# Altium schematic sheet QPA9120.SchDoc
size A4; SheetNumber: 2; SheetTotal: 4
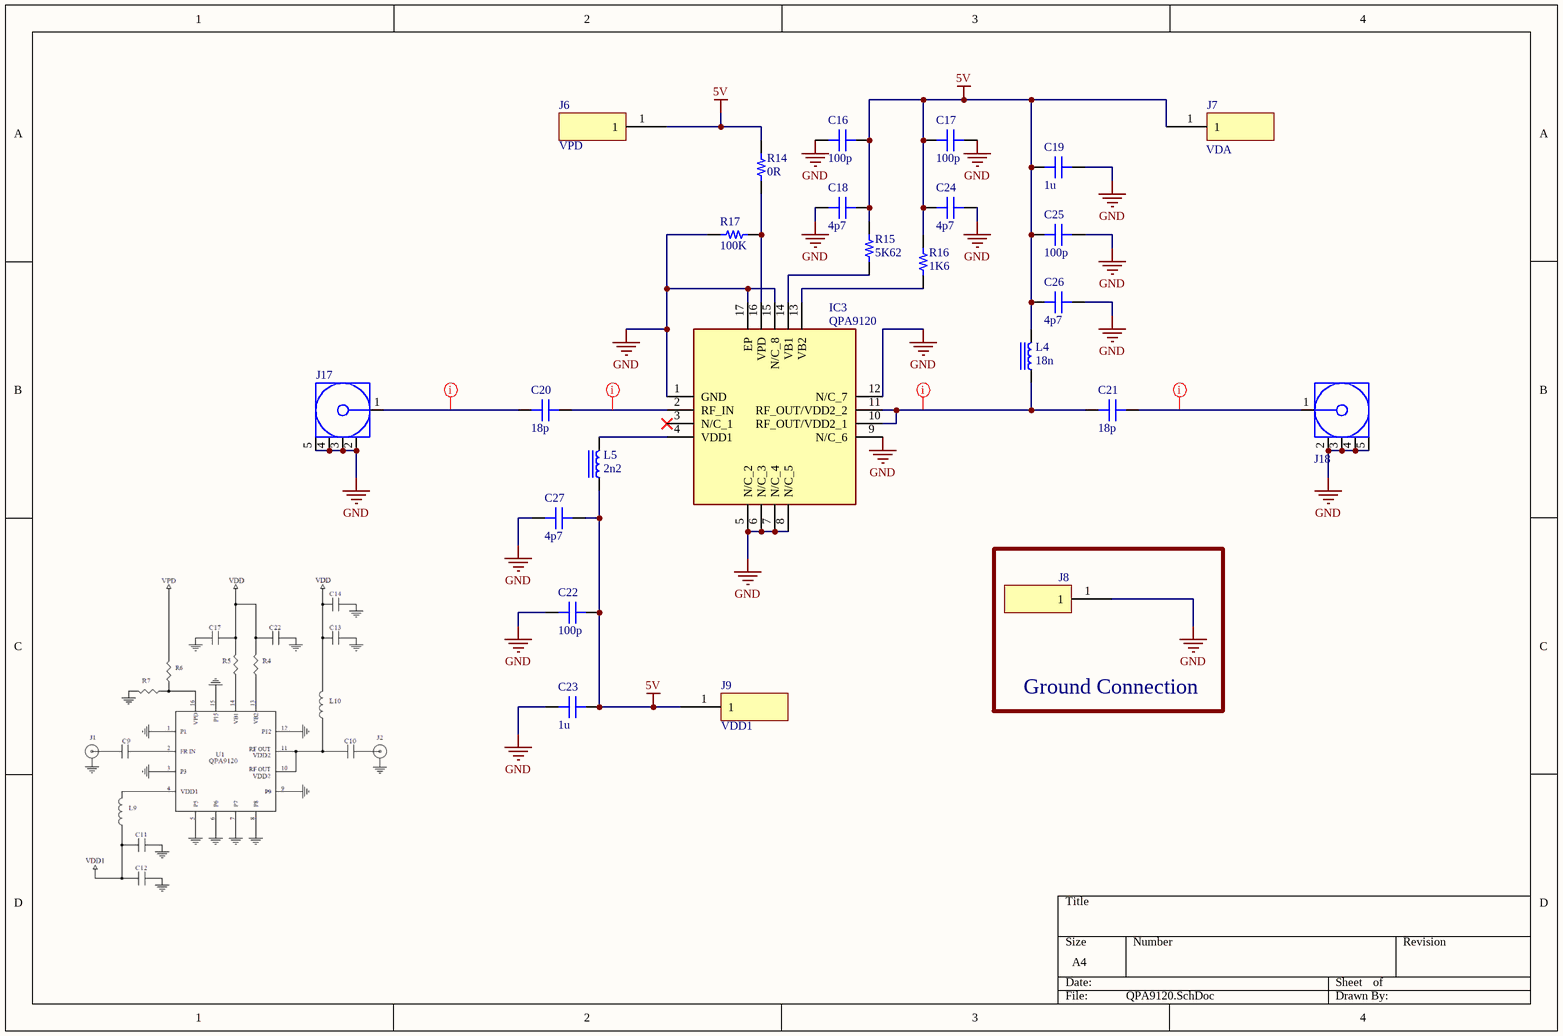
[diagram p0: QPA9120.SchDoc]

## Parts
C16  100p  [CAP 0603_1608 RF]
C17  100p  [CAP 0603_1608 RF]
C18  4p7  [CAP 0402_1005 RF]
C19  1u  [CAP 0603_1608]
C20  18p  [CAP 0402_1005 RF]
C21  18p  [CAP 0402_1005 RF]
C22  100p  [CAP 0603_1608 RF]
C23  1u  [CAP 0603_1608]
C24  4p7  [CAP 0402_1005 RF]
C25  100p  [CAP 0603_1608 RF]
C26  4p7  [CAP 0402_1005 RF]
C27  4p7  [CAP 0402_1005 RF]
IC3  QPA9120  [QFN50P300X300X86-17N-D]
J6  Nail_Head  [Nail_Head]  (value not drawn)
J7  Nail_Head  [Nail_Head]  (value not drawn)
J8  Nail_Head  [Nail_Head]  (value not drawn)
J9  Nail_Head  [Nail_Head]  (value not drawn)
J17  60312202114513  [60312202114513]  (value not drawn)
J18  60312202114513  [60312202114513]  (value not drawn)
L4  18n  [IND 0402_1005 RF WW]
L5  2n2  [IND 0402_1005 RF WW]
R14  0R  [RES 0603_1608]
R15  5K62  [RES 0402_1005]
R16  1K6  [RES 0402_1005]
R17  100K  [RES 0402_1005]

## Blocks framed on the sheet
Ground Connection: J8

## Nets
5V: C16.2 C17.1 C18.2 C19.1 C22.2 C23.2 C24.1 C25.1 C26.1 C27.2 J6.1 J7.1 J9.1 L4.2 L5.1 R14.2 R15.2 R16.2
GND: C16.1 C17.2 C18.1 C19.2 C22.1 C23.1 C24.2 C25.2 C26.2 C27.1 IC3.1(GND) IC3.5(N/C_2) IC3.6(N/C_3) IC3.7(N/C_4) IC3.8(N/C_5) IC3.9(N/C_6) IC3.12(N/C_7) IC3.15(N/C_8) IC3.17(EP) J8.1 J17.2(GND) J17.3(GND) J17.4(GND) J17.5(GND) J18.2(GND) J18.3(GND) J18.4(GND) J18.5(GND) R17.1
NetC20_1: C20.1 J17.1(Signal)
NetC20_2: C20.2 IC3.2(RF_IN)
NetC21_1: C21.1 IC3.10(RF_OUT/VDD2_1) IC3.11(RF_OUT/VDD2_2) L4.1
NetC21_2: C21.2 J18.1(Signal)
NetIC3_4: IC3.4(VDD1) L5.2
NetIC3_13: IC3.13(VB2) R16.1
NetIC3_14: IC3.14(VB1) R15.1
NetIC3_16: IC3.16(VPD) R14.1 R17.2

Not connected (* = marked no-connect by the designer): IC3 3(N/C_1)*

## Layout directives
net class CPWG: NetC20_1, NetC20_2, NetC21_1, NetC21_2

## Notes on the sheet
- (near J6) VPD
- (near J7) VDA
- (near J9) VDD1

## Library data of the parts
C16 C17 C22 C25 = 600S101GW250XT: CAP CER 100PF 250V NP0 0603; manufacturer: American Technical Ceramics; Temperature Coefficient: C0G, NP0; Tolerance: ±2%; Part Number: 600S101GW250XT; Applications: RF, Microwave, High Frequency, Bypass, Decoupling; Capacitance: 100 pF; componentlink1description: Datasheet; componentlink1url: http://www.atceramics.com/UserFiles/600s.pdf; componentlink2description: DigiKey Link; componentlink2url: https://www.digikey.com/en/products/detail/american-technical-ceramics/600S101GW250XT/3908987; Device Package: 0603 (1608 Metric); Features: High Q, Low Loss, Ultra Low ESR; lastupdated: 08/02/2024 21:16:59; Lifecycle Status: Active; Minimum Order: 1; Mounting Type: Surface Mount, MLCC; Operating Temperature: -55°C ~ 125°C; Package / Case: 0603 (1608 Metric); packaging: TapeAndReel; partid: 2165; Part Status: Active; price: 0.66; series: ATC 600S; Size / Dimension: 0.063" L x 0.032" W (1.60mm x 0.81mm); Supplier 1: DigiKey; Supplier Part Number 1: 1284-1931-1-ND; Thickness (Max): 0.035" (0.89mm); value: 100 pF; Voltage - Rated: 250V
C18 C24 C26 C27 = 600L4R7BT200T: CAP CER 4.7PF 200V C0G/NP0 0402; manufacturer: American Technical Ceramics; Temperature Coefficient: C0G, NP0; Tolerance: ±0.1pF; Part Number: 600L4R7BT200T; Applications: RF, Microwave, High Frequency, Bypass, Decoupling; Capacitance: 4.7 pF; componentlink1description: Datasheet; componentlink1url: http://www.atceramics.com/UserFiles/600l.pdf; componentlink2description: DigiKey Link; componentlink2url: https://www.digikey.com/en/products/detail/american-technical-ceramics/600L4R7BT200T/3905170; Device Package: 0402 (1005 Metric); Features: High Q, Low Loss, Ultra Low ESR; lastupdated: 08/02/2024 21:11:52; Lifecycle Status: Active; Minimum Order: 1; Mounting Type: Surface Mount, MLCC; Operating Temperature: -55°C ~ 125°C; Package / Case: 0402 (1005 Metric); packaging: TapeAndReel; partid: 546; Part Status: Active; price: 0.28; series: ATC 600L; Size / Dimension: 0.040" L x 0.020" W (1.02mm x 0.51mm); Supplier 1: DigiKey; Supplier Part Number 1: 1284-1129-1-ND; Thickness (Max): 0.024" (0.60mm); value: 4.7 pF; Voltage - Rated: 200V
C19 C23 = GCM188R71E105KA64J: CAP CER 1UF 25V X7R 0603; manufacturer: Murata Electronics; Capacitance: 1 µF; Tolerance: ±10%; Part Number: GCM188R71E105KA64J; Value: 1u; Applications: Automotive; componentlink1description: Datasheet; componentlink1url: https://www.murata.com/-/media/webrenewal/support/library/catalog/products/capacitor/ceramiccapacitor/c03e.ashx?la=en-us&cvid=20200707014404000000; componentlink2description: DigiKey Link; componentlink2url: https://www.digikey.com/en/products/detail/murata-electronics/GCM188R71E105KA64J/4903957; Device Package: 0603 (1608 Metric); lastupdated: 09/02/2024 20:09:55; Lifecycle Status: Active; Minimum Order: 1; Mounting Type: Surface Mount, MLCC; Operating Temperature: -55°C ~ 125°C; Package / Case: 0603 (1608 Metric); packaging: TapeAndReel; partid: 34745; Part Status: Active; price: 0.02; Ratings: AEC-Q200; series: GCM; Size / Dimension: 0.063" L x 0.031" W (1.60mm x 0.80mm); Supplier 1: DigiKey; Supplier Part Number 1: 490-GCM188R71E105KA64JCT-ND; Temperature Coefficient: X7R; Thickness (Max): 0.035" (0.90mm); Voltage - Rated: 25V
C20 C21 = 600L180GT200T: CAP CER 18PF 200V NP0 0402; manufacturer: American Technical Ceramics; Temperature Coefficient: C0G, NP0; Tolerance: ±2%; Part Number: 600L180GT200T; Applications: RF, Microwave, High Frequency, Bypass, Decoupling; Capacitance: 18 pF; componentlink1description: Datasheet; componentlink1url: http://www.atceramics.com/UserFiles/600l.pdf; componentlink2description: DigiKey Link; componentlink2url: https://www.digikey.com/en/products/detail/american-technical-ceramics/600L180GT200T/3908919; Device Package: 0402 (1005 Metric); Features: High Q, Low Loss, Ultra Low ESR; lastupdated: 08/02/2024 21:11:47; Lifecycle Status: Active; Minimum Order: 1; Mounting Type: Surface Mount, MLCC; Operating Temperature: -55°C ~ 125°C; Package / Case: 0402 (1005 Metric); packaging: TapeAndReel; partid: 2016; Part Status: Active; price: 0.49; series: ATC 600L; Size / Dimension: 0.040" L x 0.020" W (1.02mm x 0.51mm); Supplier 1: DigiKey; Supplier Part Number 1: 1284-1910-1-ND; Thickness (Max): 0.024" (0.60mm); value: 18 pF; Voltage - Rated: 200V
IC3 = QPA9120: Integrated Circuit; Manufacturer_Name: Qorvo; Datasheet Link: https://www.qorvo.com/products/d/da006507; Height: 0.855mm; Manufacturer_Part_Number: QPA9120; Mouser Part Number: N/A; Mouser Price/Stock: https://www.mouser.com/Search/Refine.aspx?Keyword=N%2FA
J6-J9 = Nail_Head: 1460-2-00-80-00-00-03-0 Mill-Max; Supplier 1: Farnell; Supplier Part Number 1: 3889056
J17 J18 = 60312202114513: WR-SMA Connector, PCB End Launch Jack, 6.35SQ Flange Flat Tab 1.6mm, DC~18GHz, 50Ohm; Manufacturer: Wurth Elektronik; Center Contact Diameter: 0.51 WIDE x 0.25 THK; Connector Type: SMA; Interface Type: MIL-STD-348; Manufacturer Part Number: 60312202114513; Category: Coaxial Connectors; Match Code: WR-SMA; ComponentLink1Description: Website Link; ComponentLink1URL: https://www.we-online.com/redexpert/article/60312202114513?ad; ComponentLink2Description: Datasheet Link; ComponentLink2URL: https://www.we-online.com/redexpert/spec/60312202114513?ad; Mount: End Launch; Operating Temperature Max: 165°C; Operating Temperature Min: -65°C; Packaging: Tray; Frequency Range: DC~18GHz; Gender: Jack; Impedance: 50Ohm; Orientation: Straight
L4 = LQW15AN18NG8ZD: FIXED IND 18NH 1.05A 0.13OHM SMD; Manufacturer: Murata Electronics; DC Resistance (DCR): 130mOhm Max; Frequency - Self Resonant: 5.2GHz; Inductance Frequency - Test: 100 MHz; Material - Core: Non-Magnetic; Q @ Freq: 30 @ 250MHz; Shielding: Unshielded; Tolerance: ±2%; Type: Drum Core, Wirewound; Part Number: LQW15AN18NG8ZD; ComponentLink1Description: Datasheet; ComponentLink1URL: https://search.murata.co.jp/Ceramy/image/img/P02/JELF243A-9138.pdf; ComponentLink2Description: DigiKey Link; ComponentLink2URL: https://www.digikey.com/en/products/detail/murata-electronics/LQW15AN18NG8ZD/6798772; Current Rating (Amps): 1.05 A; Device Package: 0402 (1005 Metric); Height - Seated (Max): 0.024" (0.60mm); Inductance: 18 nH; LastUpdated: 11/03/2024 07:55:40; Lifecycle Status: Active; Minimum Order: 1; Mounting Type: Surface Mount; Operating Temperature: -55°C ~ 125°C; Package / Case: 0402 (1005 Metric); Packaging: TapeAndReel; PartId: 193; Part Status: Active; Price: 0.07; Ratings: AEC-Q200; Series: LQW15; Size / Dimension: 0.039" L x 0.024" W (1.00mm x 0.60mm); Supplier 1: DigiKey; Supplier Part Number 1: 490-15347-1-ND; Supplier Device Package: 0402 (1005 Metric); Value: 18 nH
L5 = LQW15AN2N2D8ZD: FIXED IND 2.2NH 2.53A 0.022OHM; Manufacturer: Murata Electronics; DC Resistance (DCR): 22mOhm Max; Frequency - Self Resonant: 15.5GHz; Inductance Frequency - Test: 100 MHz; Material - Core: Non-Magnetic; Q @ Freq: 30 @ 250MHz; Shielding: Unshielded; Tolerance: ±0.5nH; Type: Drum Core, Wirewound; Part Number: LQW15AN2N2D8ZD; ComponentLink1Description: Datasheet; ComponentLink1URL: https://search.murata.co.jp/Ceramy/image/img/P02/JELF243A-9138.pdf; ComponentLink2Description: DigiKey Link; ComponentLink2URL: https://www.digikey.com/en/products/detail/murata-electronics/LQW15AN2N2D8ZD/6798802; Current Rating (Amps): 2.53 A; Device Package: 0402 (1005 Metric); Height - Seated (Max): 0.024" (0.60mm); Inductance: 2.2 nH; LastUpdated: 11/03/2024 07:55:41; Lifecycle Status: Active; Minimum Order: 1; Mounting Type: Surface Mount; Operating Temperature: -55°C ~ 125°C; Package / Case: 0402 (1005 Metric); Packaging: TapeAndReel; PartId: 45; Part Status: Active; Price: 0.06; Ratings: AEC-Q200; Series: LQW15; Size / Dimension: 0.039" L x 0.024" W (1.00mm x 0.60mm); Supplier 1: DigiKey; Supplier Part Number 1: 490-15377-1-ND; Supplier Device Package: 0402 (1005 Metric); Value: 2.2 nH
R14 = JR0603X26E: 0603 26 AMP JUMPER; Manufacturer: Ohmite; Power (Watts): 0.135W; Resistance: 0 Ohms; Part Number: JR0603X26E; Value: 0R; ComponentLink1Description: Datasheet; ComponentLink1URL: https://www.ohmite.com/assets/docs/res_jr.pdf?r=false; ComponentLink2Description: DigiKey Link; ComponentLink2URL: https://www.digikey.com/en/products/detail/ohmite/JR0603X26E/10233371; Composition: Metal Element; Device Package: 0603 (1608 Metric); Height - Seated (Max): 0.022" (0.55mm); LastUpdated: 12/04/2023 19:32:57; Lifecycle Status: Active; Minimum Order: 1; Number of Terminations: 2; Operating Temperature: -55°C ~ 150°C; Package / Case: 0603 (1608 Metric); Packaging: TapeAndReel; PartId: 6812; Part Status: Active; Price: 0.10; Series: JR; Size / Dimension: 0.063" L x 0.031" W (1.60mm x 0.80mm); Supplier 1: DigiKey; Supplier Part Number 1: JR0603X26ECT-ND; Supplier Device Package: 0603; Tolerance: Jumper
R15 = CRCW04025K62FKED: RES SMD 5.62K OHM 1% 1/16W 0402; Manufacturer: Vishay Dale; Power (Watts): 0.063W, 1/16W; Resistance: 5.62 kOhms; Temperature Coefficient: ±100ppm/°C; Part Number: CRCW04025K62FKED; Value: 5K62; ComponentLink1Description: Datasheet; ComponentLink1URL: http://www.vishay.com/docs/20035/dcrcwe3.pdf; ComponentLink2Description: DigiKey Link; ComponentLink2URL: https://www.digikey.com/en/products/detail/vishay-dale/CRCW04025K62FKED/1178093; Composition: Thick Film; Device Package: 0402 (1005 Metric); Features: Automotive AEC-Q200; Height - Seated (Max): 0.016" (0.40mm); LastUpdated: 09/02/2024 20:29:38; Lifecycle Status: Active; Minimum Order: 1; Number of Terminations: 2; Operating Temperature: -55°C ~ 155°C; Package / Case: 0402 (1005 Metric); Packaging: TapeAndReel; PartId: 16234; Part Status: Active; Price: 0.01; Ratings: AEC-Q200; Series: CRCW; Size / Dimension: 0.039" L x 0.020" W (1.00mm x 0.50mm); Supplier 1: DigiKey; Supplier Part Number 1: 541-5.62KLCT-ND; Supplier Device Package: 0402; Tolerance: ±1%
R16 = CR0402-FX-1601GLF: RES SMD 1.6K OHM 1% 1/16W 0402; Manufacturer: Bourns Inc.; Power (Watts): 0.063W, 1/16W; Resistance: 1.6 kOhms; Temperature Coefficient: ±100ppm/°C; Part Number: CR0402-FX-1601GLF; Value: 1K6; ComponentLink1Description: Datasheet; ComponentLink1URL: https://www.bourns.com/docs/Product-Datasheets/CR0402.pdf; ComponentLink2Description: DigiKey Link; ComponentLink2URL: https://www.digikey.com/en/products/detail/bourns-inc/CR0402-FX-1601GLF/3783173; Composition: Thick Film; Device Package: 0402 (1005 Metric); Height - Seated (Max): 0.016" (0.40mm); LastUpdated: 09/02/2024 20:29:47; Lifecycle Status: Active; Minimum Order: 1; Number of Terminations: 2; Operating Temperature: -55°C ~ 155°C; Package / Case: 0402 (1005 Metric); Packaging: CutTape; PartId: 12857; Part Status: Active; Price: 0.01; Series: CR0402; Size / Dimension: 0.039" L x 0.020" W (1.00mm x 0.50mm); Supplier 1: DigiKey; Supplier Part Number 1: CR0402-FX-1601GLFCT-ND; Supplier Device Package: 0402; Tolerance: ±1%
R17 = CRCW0402100KFKEDHP: RES SMD 100K OHM 1% 1/5W 0402; Manufacturer: Vishay Dale; Power (Watts): 0.2W, 1/5W; Resistance: 100 kOhms; Temperature Coefficient: ±100ppm/°C; Part Number: CRCW0402100KFKEDHP; Value: 100K; ComponentLink1Description: Datasheet; ComponentLink1URL: http://www.vishay.com/docs/20043/crcwhpe3.pdf; ComponentLink2Description: DigiKey Link; ComponentLink2URL: https://www.digikey.com/en/products/detail/vishay-dale/CRCW0402100KFKEDHP/2222540; Composition: Thick Film; Device Package: 0402 (1005 Metric); Features: Automotive AEC-Q200, Pulse Withstanding; Height - Seated (Max): 0.016" (0.40mm); LastUpdated: 09/02/2024 20:29:48; Lifecycle Status: Active; Minimum Order: 1; Number of Terminations: 2; Operating Temperature: -55°C ~ 155°C; Package / Case: 0402 (1005 Metric); Packaging: TapeAndReel; PartId: 12749; Part Status: Active; Price: 0.01; Ratings: AEC-Q200; Series: CRCW-HP; Size / Dimension: 0.039" L x 0.020" W (1.00mm x 0.50mm); Supplier 1: DigiKey; Supplier Part Number 1: 541-100KYCT-ND; Supplier Device Package: 0402; Tolerance: ±1%